# Altium schematic sheet 09.RK3399 Misc.SchDoc
size A4; SheetNumber: 9; SheetTotal: 10
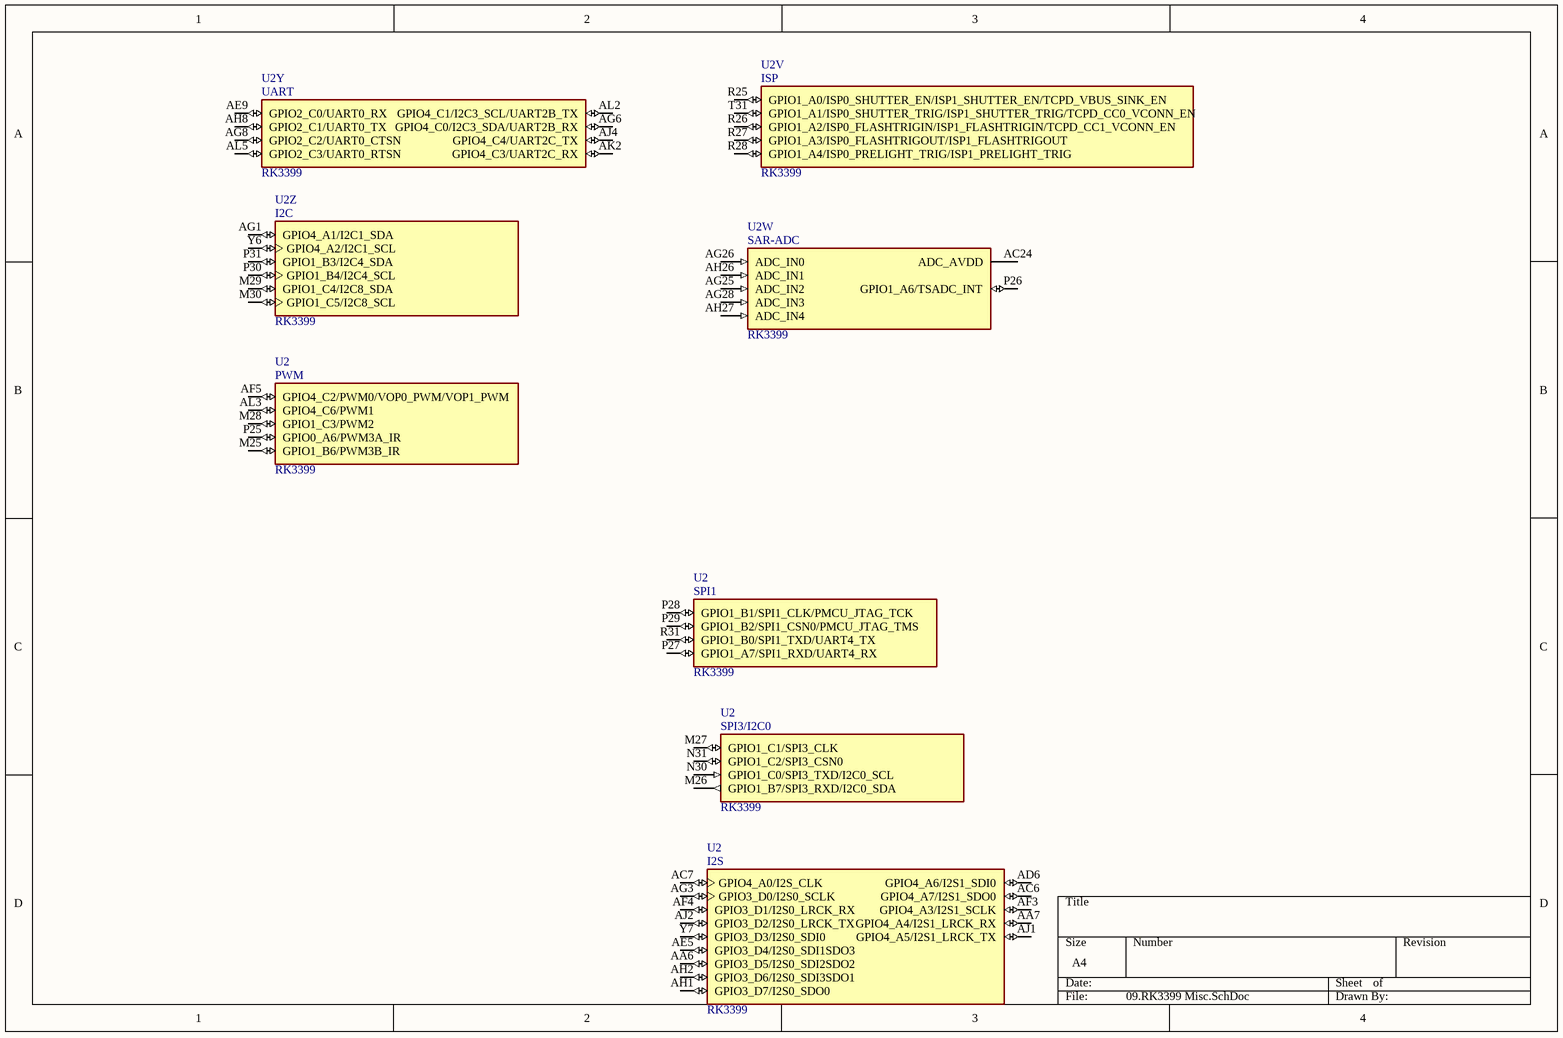
[diagram p0: 09.RK3399 Misc.SchDoc]

## Parts
U2  RK3399  [BGA828C65P31X31_2100X2100X161N]  (parts V,W,Y,Z,27,30,31,32 of 32)

## Nets

Not connected (* = marked no-connect by the designer): U2 AA6(GPIO3_D5/I2S0_SDI2SDO2) AA7(GPIO4_A4/I2S1_LRCK_RX) AC6(GPIO4_A7/I2S1_SDO0) AC7(GPIO4_A0/I2S_CLK) AC24(ADC_AVDD) AD6(GPIO4_A6/I2S1_SDI0) AE5(GPIO3_D4/I2S0_SDI1SDO3) AE9(GPIO2_C0/UART0_RX) AF3(GPIO4_A3/I2S1_SCLK) AF4(GPIO3_D1/I2S0_LRCK_RX) AF5(GPIO4_C2/PWM0/VOP0_PWM/VOP1_PWM) AG1(GPIO4_A1/I2C1_SDA) AG3(GPIO3_D0/I2S0_SCLK) AG6(GPIO4_C0/I2C3_SDA/UART2B_RX) AG8(GPIO2_C2/UART0_CTSN) AG25(ADC_IN2) AG26(ADC_IN0) AG28(ADC_IN3) AH1(GPIO3_D7/I2S0_SDO0) AH2(GPIO3_D6/I2S0_SDI3SDO1) AH8(GPIO2_C1/UART0_TX) AH26(ADC_IN1) AH27(ADC_IN4) AJ1(GPIO4_A5/I2S1_LRCK_TX) AJ2(GPIO3_D2/I2S0_LRCK_TX) AJ4(GPIO4_C4/UART2C_TX) AK2(GPIO4_C3/UART2C_RX) AL2(GPIO4_C1/I2C3_SCL/UART2B_TX) AL3(GPIO4_C6/PWM1) AL5(GPIO2_C3/UART0_RTSN) M25(GPIO1_B6/PWM3B_IR) M26(GPIO1_B7/SPI3_RXD/I2C0_SDA) M27(GPIO1_C1/SPI3_CLK) M28(GPIO1_C3/PWM2) M29(GPIO1_C4/I2C8_SDA) M30(GPIO1_C5/I2C8_SCL) N30(GPIO1_C0/SPI3_TXD/I2C0_SCL) N31(GPIO1_C2/SPI3_CSN0) P25(GPIO0_A6/PWM3A_IR) P26(GPIO1_A6/TSADC_INT) P27(GPIO1_A7/SPI1_RXD/UART4_RX) P28(GPIO1_B1/SPI1_CLK/PMCU_JTAG_TCK) P29(GPIO1_B2/SPI1_CSN0/PMCU_JTAG_TMS) P30(GPIO1_B4/I2C4_SCL) P31(GPIO1_B3/I2C4_SDA) R25(GPIO1_A0/ISP0_SHUTTER_EN/ISP1_SHUTTER_EN/TCPD_VBUS_SINK_EN) R26(GPIO1_A2/ISP0_FLASHTRIGIN/ISP1_FLASHTRIGIN/TCPD_CC1_VCONN_EN) R27(GPIO1_A3/ISP0_FLASHTRIGOUT/ISP1_FLASHTRIGOUT) R28(GPIO1_A4/ISP0_PRELIGHT_TRIG/ISP1_PRELIGHT_TRIG) R31(GPIO1_B0/SPI1_TXD/UART4_TX) T31(GPIO1_A1/ISP0_SHUTTER_TRIG/ISP1_SHUTTER_TRIG/TCPD_CC0_VCONN_EN) Y6(GPIO4_A2/I2C1_SCL) Y7(GPIO3_D3/I2S0_SDI0)

## Notes on the sheet
- (in symbol RK3399, part V) ISP
- (in symbol RK3399, part W) SAR-ADC
- (in symbol RK3399, part Y) UART
- (in symbol RK3399, part Z) I2C
- (in symbol RK3399, part 27) PWM
- (in symbol RK3399, part 30) SPI1
- (in symbol RK3399, part 31) SPI3/I2C0
- (in symbol RK3399, part 32) I2S

## Library data of the parts
U2 = RK3399: RK3399 ROCK Pi 4 Model A 2GB - ARMÂ® CortexÂ®-A53, CortexÂ®-A72 MPU Embedded Evaluation Board; MF: Rockchip; SnapEDA_Link: https://www.snapeda.com/parts/RK3399/Fuzhou+Rockchip+Electronics+Co/view-part/?ref=snap; Package: Seeed Technology; MP: RK3399; Check_prices: https://www.snapeda.com/parts/RK3399/Fuzhou+Rockchip+Electronics+Co/view-part/?ref=eda; Price: None; Value: *; Availability: Not in stock